# Altium schematic sheet Part20_UART_BLE.SchDoc
size A4
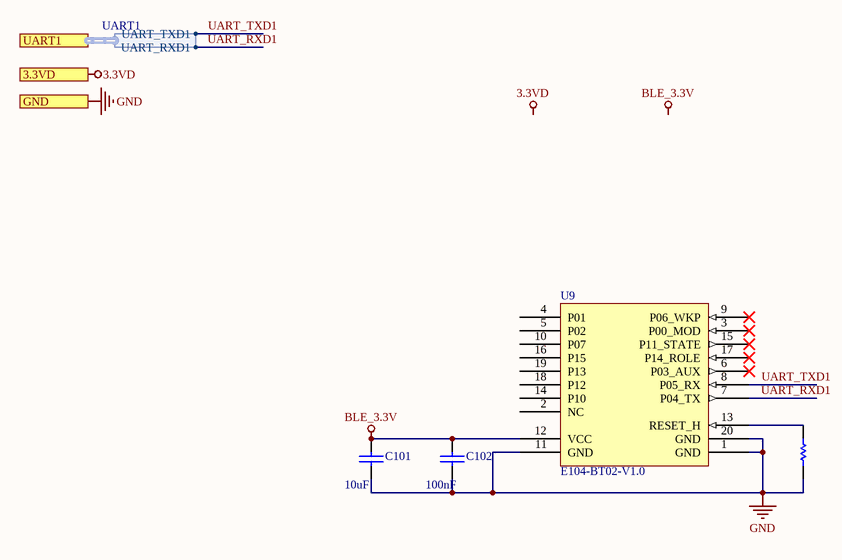
[diagram p0: Part20_UART_BLE.SchDoc]

## Parts
C101  10uF  [0603C]
C102  100nF  [0603C]
R82  470R  [0402R]  (value not drawn)
U9  E104-BT02-V1.0  [PE104-BT02]

## Ports
3.3VD, GND, UART1 (harness UART1)

## Harnesses
UART1: UART_TXD1, UART_RXD1

## Nets
3.3VD: port 3.3VD
BLE_3.3V: C101.2 C102.2 U9.12(VCC)
GND: C101.1 C102.1 R82.1 U9.1(GND) U9.11(GND) U9.20(GND) ; port GND
UART_RXD1: U9.7(P04_TX) ; port UART1.UART_RXD1
UART_TXD1: U9.8(P05_RX) ; port UART1.UART_TXD1
NetR82_2: R82.2 U9.13(RESET_H)

Not connected (* = marked no-connect by the designer): U9 2(NC) 3(P00_MOD)* 4(P01) 5(P02) 6(P03_AUX)* 9(P06_WKP)* 10(P07) 14(P10) 15(P11_STATE)* 16(P15) 17(P14_ROLE)* 18(P12) 19(P13)

## Notes on the sheet
- Labels drawn without touching a wire or pin: 3.3VD, BLE_3.3V

## Library data of the parts
C101 C102 = CAP: 无极性电容
R82 = RES